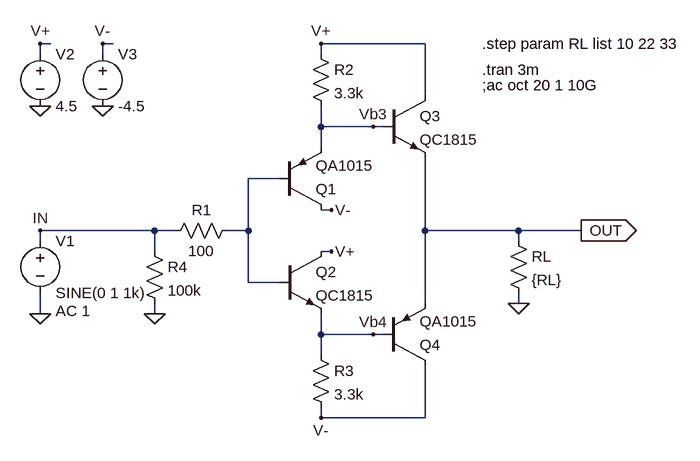
[diagram p0: schematic Push-Pull_Diamod.asc]
Push-Pull_Diamod.asc, the LTspice schematic file:
Version 4
SHEET 1 1016 680
WIRE -208 -128 -224 -128
WIRE -112 -128 -128 -128
WIRE 368 -128 208 -128
WIRE -224 -112 -224 -128
WIRE -128 -112 -128 -128
WIRE 208 -112 208 -128
WIRE 368 -48 368 -128
WIRE 208 0 208 -32
WIRE 288 0 208 0
WIRE 304 0 288 0
WIRE 208 32 208 0
WIRE 144 80 96 80
WIRE 224 128 208 128
WIRE -48 160 -224 160
WIRE -16 160 -48 160
WIRE 96 160 96 80
WIRE 96 160 64 160
WIRE 368 160 368 48
WIRE 512 160 368 160
WIRE 608 160 512 160
WIRE -224 176 -224 160
WIRE 512 176 512 160
WIRE -48 192 -48 160
WIRE 224 192 208 192
WIRE 96 240 96 160
WIRE 144 240 96 240
WIRE 368 272 368 160
WIRE 512 272 512 256
WIRE -224 288 -224 256
WIRE -48 288 -48 272
WIRE 208 320 208 288
WIRE 288 320 208 320
WIRE 304 320 288 320
WIRE 208 352 208 320
WIRE 208 448 208 432
WIRE 368 448 368 368
WIRE 368 448 208 448
FLAG 224 128 V-
FLAG 224 192 V+
FLAG 208 -128 V+
FLAG 208 448 V-
FLAG 608 160 OUT
IOPIN 608 160 Out
FLAG -48 288 0
FLAG -224 -32 0
FLAG -128 -32 0
FLAG -224 -128 V+
FLAG -128 -128 V-
FLAG -224 288 0
FLAG 512 272 0
FLAG 288 0 Vb3
FLAG 288 320 Vb4
FLAG -224 160 IN
SYMBOL npn 144 192 R0
SYMATTR InstName Q2
SYMATTR Value QC1815
SYMBOL pnp 144 128 M180
SYMATTR InstName Q1
SYMATTR Value QA1015
SYMBOL res 80 144 R90
WINDOW 0 0 56 VBottom 2
WINDOW 3 32 56 VTop 2
SYMATTR InstName R1
SYMATTR Value 100
SYMBOL npn 304 -48 R0
SYMATTR InstName Q3
SYMATTR Value QC1815
SYMBOL pnp 304 368 M180
SYMATTR InstName Q4
SYMATTR Value QA1015
SYMBOL res 192 -128 R0
SYMATTR InstName R2
SYMATTR Value 3.3k
SYMBOL res 192 336 R0
SYMATTR InstName R3
SYMATTR Value 3.3k
SYMBOL voltage -224 160 R0
WINDOW 123 24 124 Left 2
WINDOW 39 0 0 Left 2
SYMATTR Value2 AC 1
SYMATTR InstName V1
SYMATTR Value SINE(0 1 1k)
SYMBOL res -64 176 R0
SYMATTR InstName R4
SYMATTR Value 100k
SYMBOL voltage -224 -128 R0
WINDOW 123 0 0 Left 2
WINDOW 39 0 0 Left 2
SYMATTR InstName V2
SYMATTR Value 4.5
SYMBOL voltage -128 -128 R0
WINDOW 123 0 0 Left 2
WINDOW 39 0 0 Left 2
SYMATTR InstName V3
SYMATTR Value -4.5
SYMBOL res 496 160 R0
SYMATTR InstName RL
SYMATTR Value {RL}
TEXT 456 -88 Left 2 !.tran 3m
TEXT 456 -128 Left 2 !.step param RL list 10 22 33
TEXT 456 -64 Left 2 !;ac oct 20 1 10G

The netlist it stands for:
* Push-Pull_Diamod.asc
Q2 V+ N001 Vb4 0 QC1815
Q1 V- N001 Vb3 0 QA1015
R1 N001 IN 100
Q3 V+ Vb3 OUT 0 QC1815
Q4 V- Vb4 OUT 0 QA1015
R2 V+ Vb3 3.3k
R3 Vb4 V- 3.3k
V1 IN 0 SINE(0 1 1k) AC 1
R4 IN 0 100k
V2 V+ 0 4.5
V3 V- 0 -4.5
RL OUT 0 {RL}
.model NPN NPN
.model PNP PNP
.lib standard.bjt
.tran 3m
.step param RL list 10 22 33
;ac oct 20 1 10G
.backanno
.end